# Altium schematic sheet Main.SchDoc: =ProjectName
size A4; CheckedBy: DatNB; Author: Ven; CompanyName: Nacentech; Organization: IMET
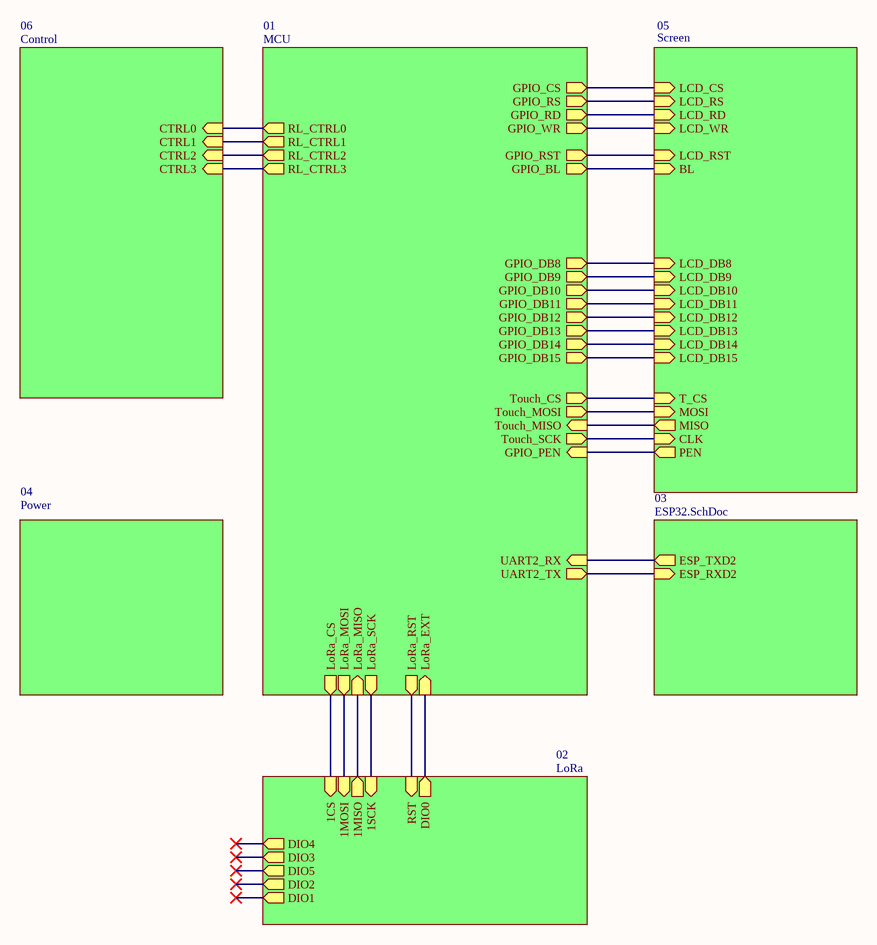
[diagram p0: Main.SchDoc]

## Sub-sheets
01 = MCU: GPIO_DB10 (out), GPIO_PEN (in), GPIO_DB13 (out), UART2_RX (in), GPIO_DB12 (out), LoRa_EXT (in), GPIO_WR (out), GPIO_RD (out), LoRa_RST (out), GPIO_DB14 (out), LoRa_CS (out), GPIO_BL (out), Touch_CS (out), Touch_SCK (out), GPIO_CS (out), LoRa_MOSI (out), LoRa_SCK (out), Touch_MOSI (out), GPIO_DB8 (out), LoRa_MISO (in), GPIO_RST (out), GPIO_DB15 (out), UART2_TX (out), GPIO_DB11 (out), GPIO_DB9 (out), GPIO_RS (out), Touch_MISO (in), RL_CTRL3 (out), RL_CTRL0 (out), RL_CTRL1 (out), RL_CTRL2 (out)
02 = LoRa: 1MOSI (in), DIO5 (out), DIO3 (out), DIO4 (out), DIO2 (out), 1SCK (in), DIO1 (out), DIO0 (out), RST (in), 1CS (in), 1MISO (out)
03 = ESP32.SchDoc: ESP_TXD2 (out), ESP_RXD2 (in)
04 = Power: no entries
05 = Screen: CLK (in), LCD_DB15 (in), MISO (out), T_CS (in), LCD_DB12 (in), LCD_DB9 (in), LCD_DB13 (in), BL (in), LCD_RS (in), LCD_DB10 (in), LCD_DB8 (in), PEN (out), LCD_RD (in), MOSI (in), LCD_DB14 (in), LCD_DB11 (in), LCD_WR (in), LCD_RST (in), LCD_CS (in)
06 = Control: CTRL0 (in), CTRL2 (in), CTRL1 (in), CTRL3 (in)

## Nets
(unnamed): sheet 01/GPIO_DB10, sheet 05/LCD_DB10
(unnamed): sheet 01/GPIO_PEN, sheet 05/PEN
(unnamed): sheet 01/GPIO_DB13, sheet 05/LCD_DB13
(unnamed): sheet 01/UART2_RX, sheet 03/ESP_TXD2
(unnamed): sheet 01/GPIO_DB12, sheet 05/LCD_DB12
(unnamed): sheet 01/LoRa_EXT, sheet 02/DIO0
(unnamed): sheet 01/GPIO_WR, sheet 05/LCD_WR
(unnamed): sheet 01/GPIO_RD, sheet 05/LCD_RD
(unnamed): sheet 01/LoRa_RST, sheet 02/RST
(unnamed): sheet 01/GPIO_DB14, sheet 05/LCD_DB14
(unnamed): sheet 01/LoRa_CS, sheet 02/1CS
(unnamed): sheet 01/GPIO_BL, sheet 05/BL
(unnamed): sheet 01/Touch_CS, sheet 05/T_CS
(unnamed): sheet 01/Touch_SCK, sheet 05/CLK
(unnamed): sheet 01/GPIO_CS, sheet 05/LCD_CS
(unnamed): sheet 01/LoRa_MOSI, sheet 02/1MOSI
(unnamed): sheet 01/LoRa_SCK, sheet 02/1SCK
(unnamed): sheet 01/Touch_MOSI, sheet 05/MOSI
(unnamed): sheet 01/GPIO_DB8, sheet 05/LCD_DB8
(unnamed): sheet 01/LoRa_MISO, sheet 02/1MISO
(unnamed): sheet 01/GPIO_RST, sheet 05/LCD_RST
(unnamed): sheet 01/GPIO_DB15, sheet 05/LCD_DB15
(unnamed): sheet 01/UART2_TX, sheet 03/ESP_RXD2
(unnamed): sheet 01/GPIO_DB11, sheet 05/LCD_DB11
(unnamed): sheet 01/GPIO_DB9, sheet 05/LCD_DB9
(unnamed): sheet 01/GPIO_RS, sheet 05/LCD_RS
(unnamed): sheet 01/Touch_MISO, sheet 05/MISO
(unnamed): sheet 01/RL_CTRL3, sheet 06/CTRL3
(unnamed): sheet 01/RL_CTRL0, sheet 06/CTRL0
(unnamed): sheet 01/RL_CTRL1, sheet 06/CTRL1
(unnamed): sheet 01/RL_CTRL2, sheet 06/CTRL2

## Notes on the sheet
- Project:
- Page Contents:
- Size:
- Date:
- A4
- Checked by:
- Time:
- Revision:
- Sheet
- of
- File: